# Altium schematic sheet RibbonCable.SchDoc
size A4; SheetNumber: 8; SheetTotal: 8
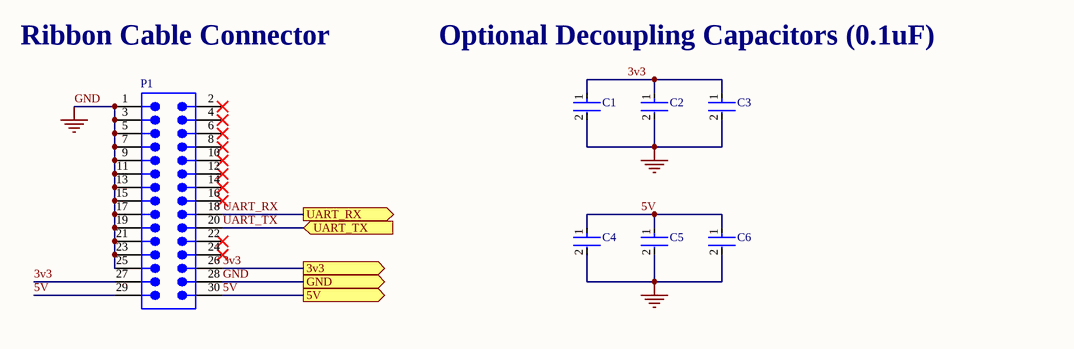
[diagram p0: RibbonCable.SchDoc]

## Parts
C1  GRM033C71C104KE14D  [FP-GRM033-0_03-MFG]  (value not drawn)
C2  GRM033C71C104KE14D  [FP-GRM033-0_03-MFG]  (value not drawn)
C3  GRM033C71C104KE14D  [FP-GRM033-0_03-MFG]  (value not drawn)
C4  GRM033C71C104KE14D  [FP-GRM033-0_03-MFG]  (value not drawn)
C5  GRM033C71C104KE14D  [FP-GRM033-0_03-MFG]  (value not drawn)
C6  GRM033C71C104KE14D  [FP-GRM033-0_03-MFG]  (value not drawn)
P1  62703021721  [62703021721]  (value not drawn)

## Ports
3v3 (out, see root[1B], Power[1A]), 5V (out, see root[1B]), GND (out, see root[1C]), UART_RX (out, see root[1B]), UART_TX (in, see root[1B])

## Nets
GND: C1.2 C2.2 C3.2 C4.2 C5.2 C6.2 P1.1 P1.3 P1.5 P1.7 P1.9 P1.11 P1.13 P1.15 P1.17 P1.19 P1.21 P1.23 P1.25 P1.28 ; port GND
3v3: C1.1 C2.1 C3.1 P1.26 P1.27 ; port 3v3
5V: C4.1 C5.1 C6.1 P1.29 P1.30 ; port 5V
UART_RX: P1.18 ; port UART_RX
UART_TX: P1.20 ; port UART_TX

Not connected (* = marked no-connect by the designer): P1 2* 4* 6* 8* 10* 12* 14* 16* 22* 24*

## Notes on the sheet
- Ribbon Cable Connector
- Optional Decoupling Capacitors (0.1uF)

## Library data of the parts
C1-C6 = CMP-06035-019037-1: Chip Multilayer Ceramic Capacitors for General Purpose, 0201, 0.10uF, X7S, 22%, 10%, 16V; Capacitance: 100nF; Dielectric: X7S; Tolerance: 10%; Voltage Rating (DC): 16V; Height: 0.3mm; Max Operating Temperature: 125°C; Case Code (Metric): 0603; Termination: SMD/SMT; Min Operating Temperature: -55°C; Mount: Surface Mount; Case/Package: 0201; Weight: 1.2E-05oz; Package Quantity: 15000; Length: 0.024inch; Voltage Rating: 16V; Case Code (Imperial): 0201; Packaging: Tape and Reel; Thickness: 0.013inch; Width: 0.3mm
P1 = CMP-03913-122639960-1: 62703021721 Conn, R/A Header, 30Pos, 2Row, 1.27Mm Rohs Compliant: Yes; Insulation Resistance: 1GΩ; Current Rating: 1A; Number of Pins: 30; Length: 23.82mm; Pitch: 1.27mm; Max Operating Temperature: 105°C; NexarPartId: 122639960; RoHS: Compliant; Min Operating Temperature: -40°C